# EAGLE design ResponseBoxBncBreakOutV2 (EAGLE 7.3.0)
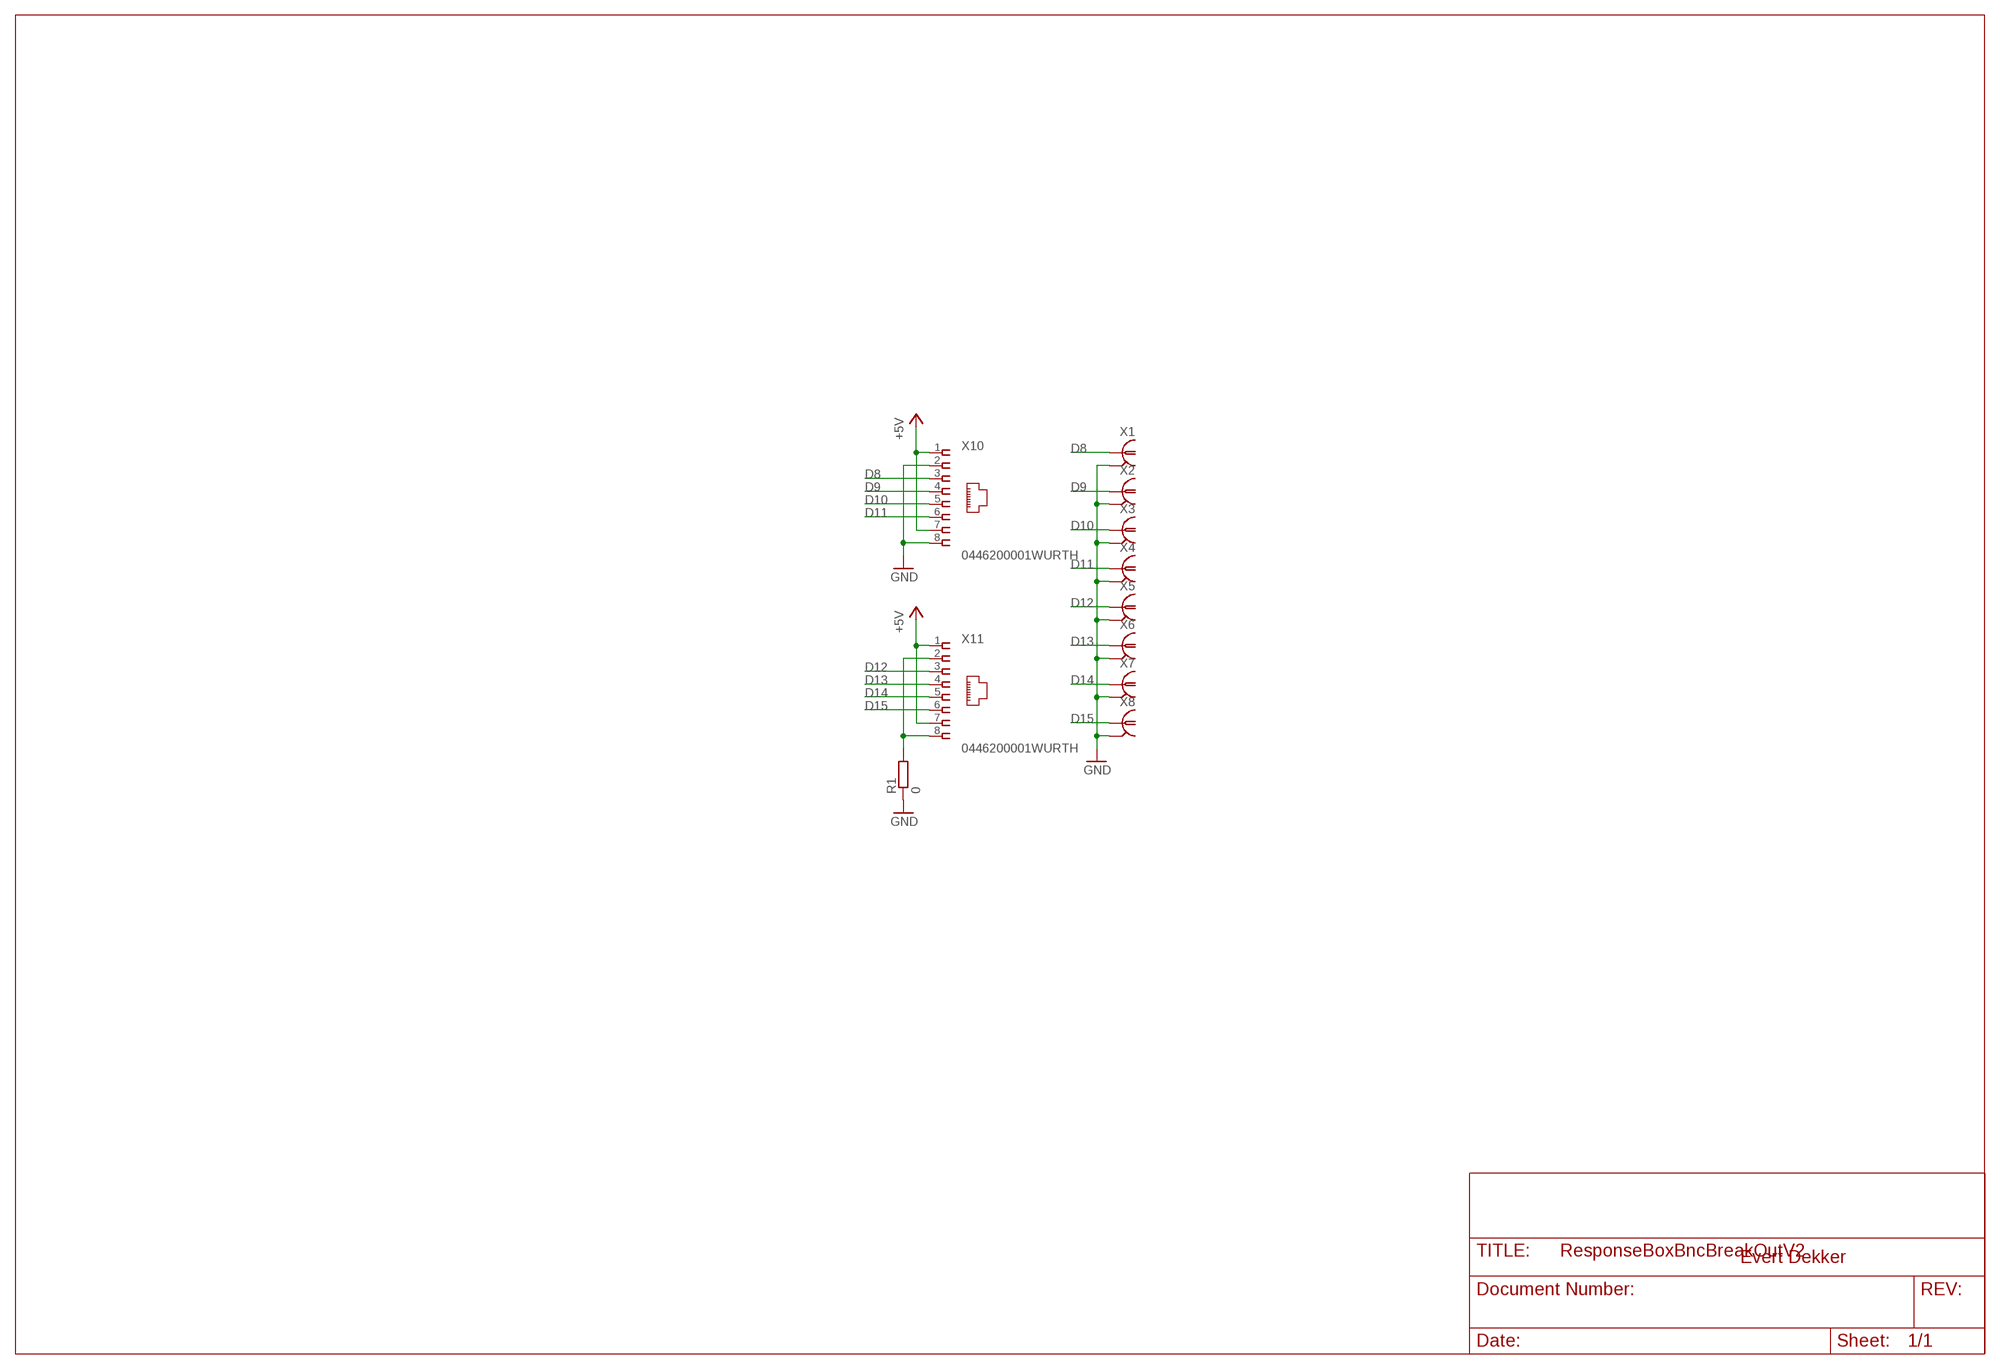
[diagram p0: schematic, sheet 1]

## Parts
R1  0  R-EU_M0805  [M0805]
X1  R141426  [R141426]
X2  R141426  [R141426]
X3  R141426  [R141426]
X4  R141426  [R141426]
X5  R141426  [R141426]
X6  R141426  [R141426]
X7  R141426  [R141426]
X8  R141426  [R141426]
X10  0446200001WURTH  [WURTH-WR-MJ]
X11  0446200001WURTH  [WURTH-WR-MJ]

## Nets
+5V [Vcc]: X10.1 X10.7 X11.1 X11.7
D8: X1.1 X10.3
D9: X2.1 X10.4
D10: X3.1 X10.5
D11: X4.1 X10.6
D12: X5.1 X11.3
D13: X6.1 X11.4
D14: X7.1 X11.5
D15: X8.1 X11.6
GND: R1.1 X1.2 X1.3 X1.4 X1.5 X2.2 X2.3 X2.4 X2.5 X3.2 X3.3 X3.4 X3.5 X4.2 X4.3 X4.4 X4.5 X5.2 X5.3 X5.4 X5.5 X6.2 X6.3 X6.4 X6.5 X7.2 X7.3 X7.4 X7.5 X8.2 X8.3 X8.4 X8.5 X10.2 X10.8
N$1: R1.2 X11.2 X11.8

## Notes on the sheet
- Evert Dekker

## Library data of the parts
R1 = rcl:R-EU_: RESISTOR, European symbol
X1-X8 = con-coax:R141426: BNC COAX CONNECTOR Radiall 50/75 Ohm Spoerle; MF: FARNELL; MPN: R141426161; OC_FARNELL: 4195115; OC_NEWARK: 14J7919
X10 X11 = Rj45Wurth:0446200001: RJ-45 INVERTED MODULAR JACK ASSEMBLY WITH RJ-11 KEEPOUT FEATURE Source: Data sheet <http://www.farnell.com/datasheets/73207.pdf>; FARNELL: 1841170

## Net classes
0 default: width 0.305 mm, clearance 0.203 mm
1 RowCols: width 0.356 mm, clearance 0.203 mm
2 Vcc: width 0.356 mm, clearance 0.203 mm

## Board
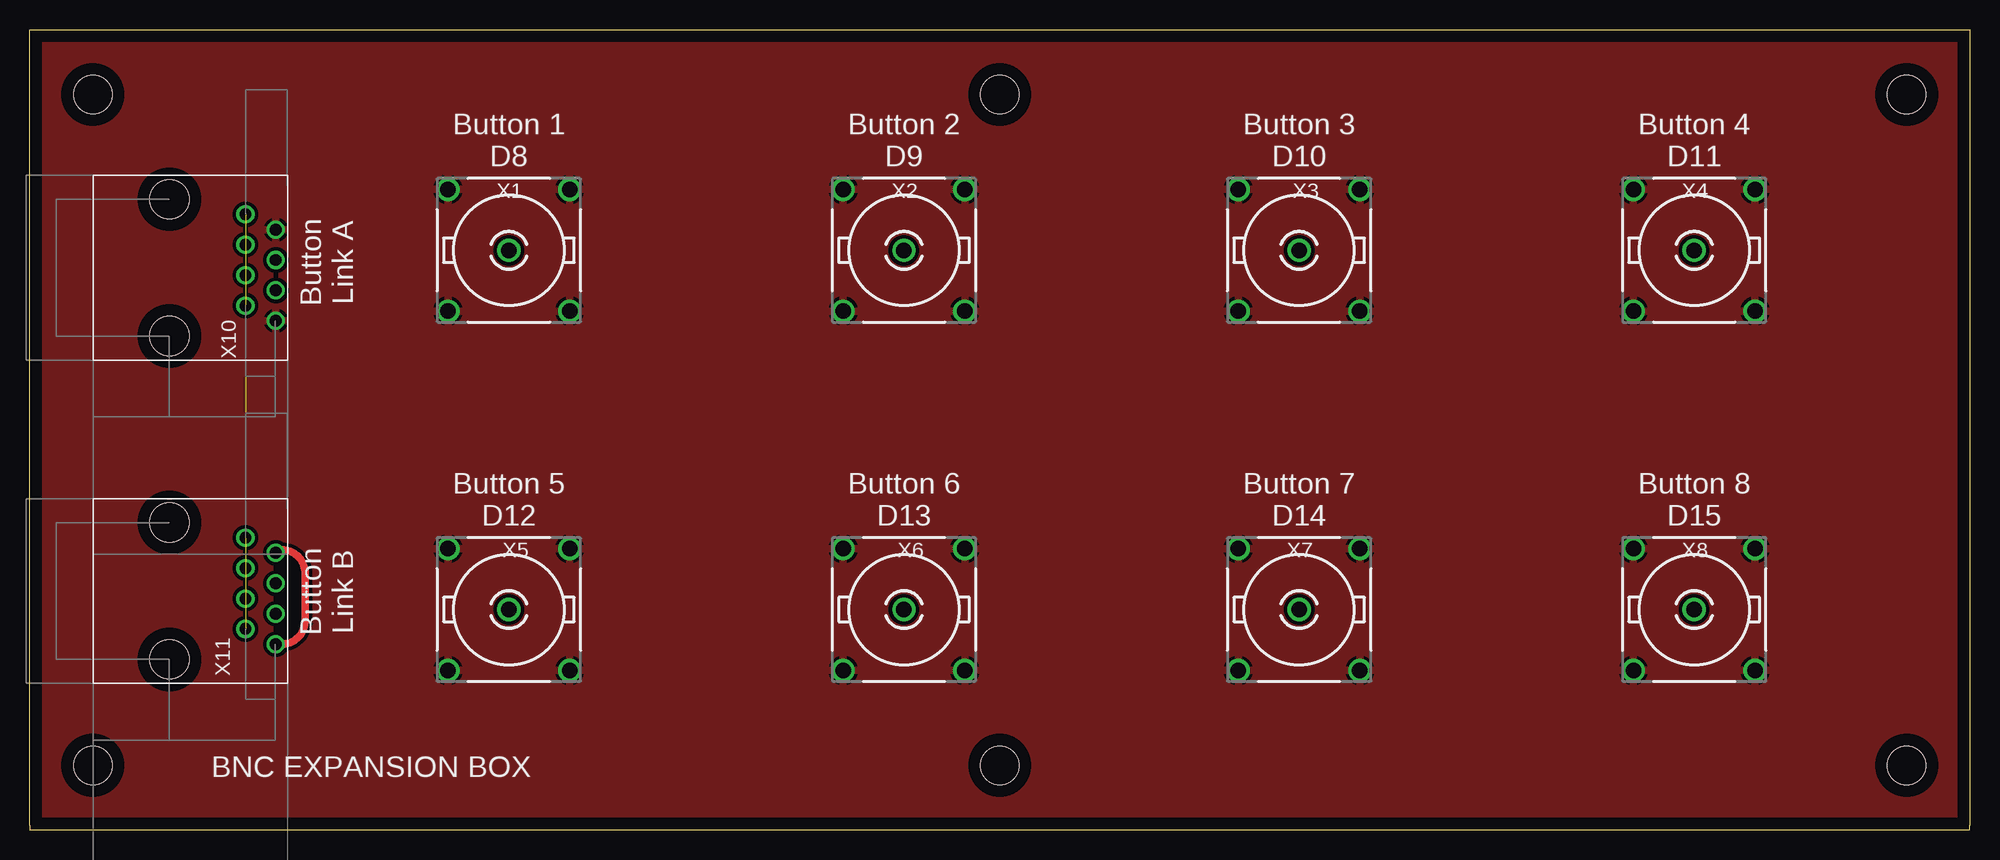
[diagram p1: board, top side]
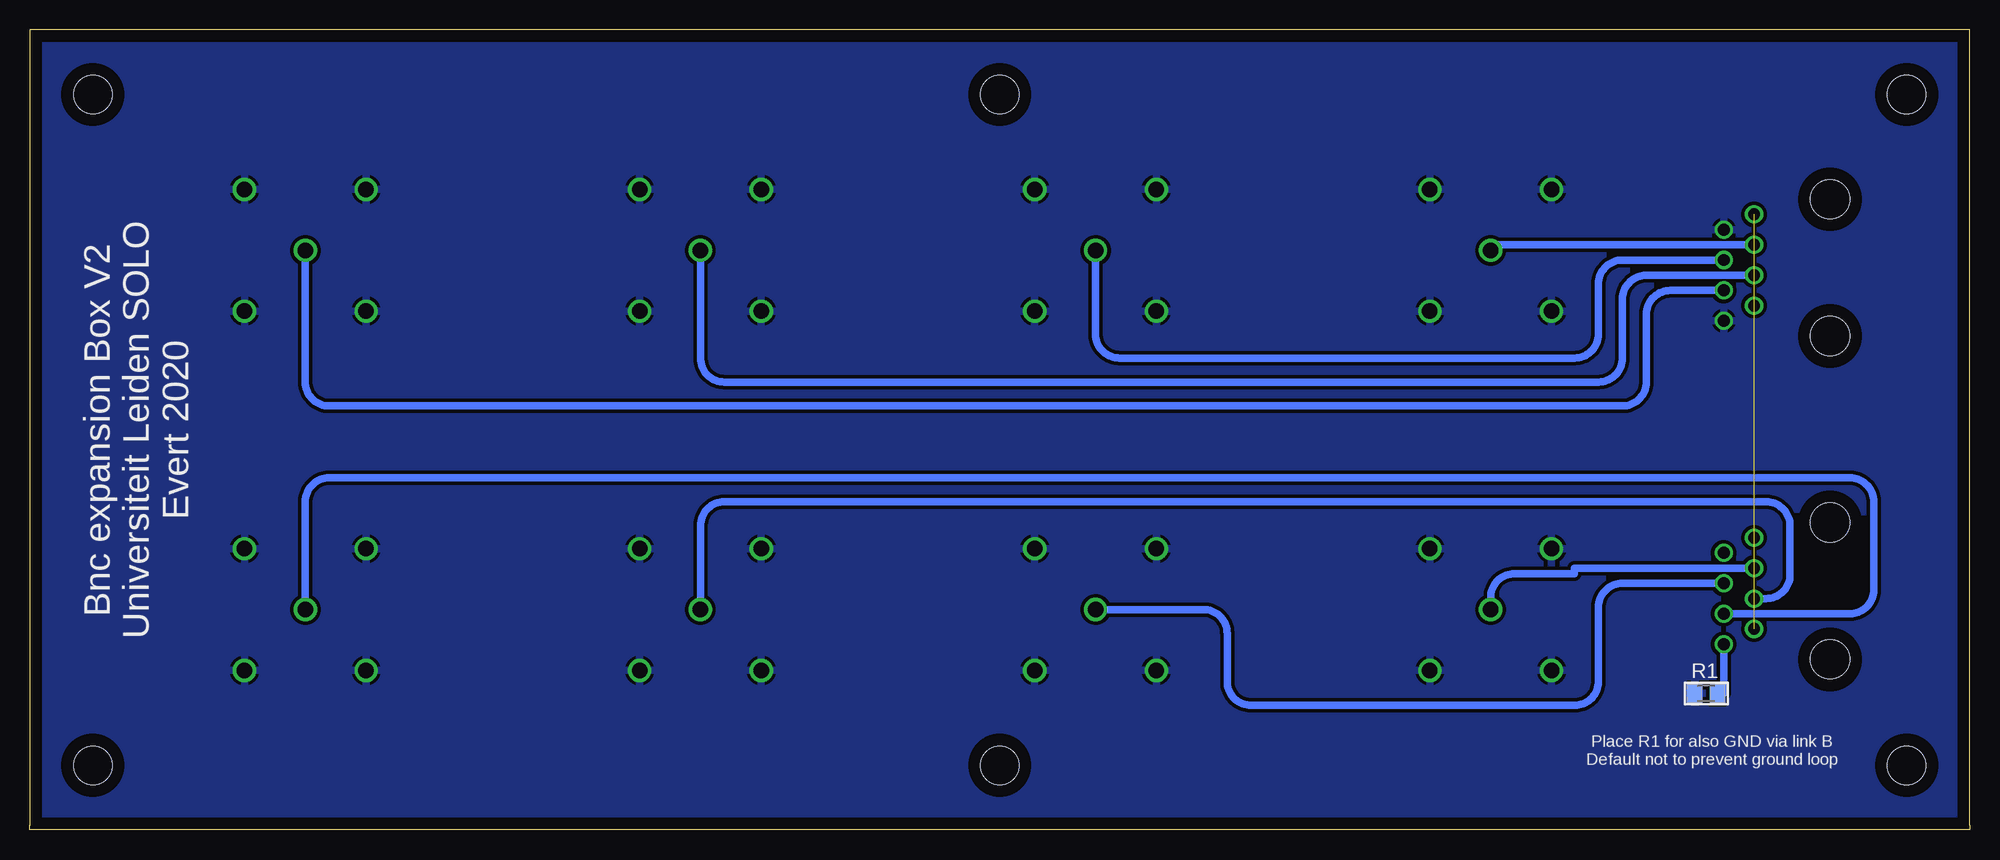
[diagram p2: board, bottom side, seen from below]

Size 162 x 66.8 mm. Coordinates in mm from the lower left corner, seen from the top.
Outline: 162,66.4 162,0.4 162,0 0,0 0,0.4 0,66.4 0,66.8 162,66.8 162,66.4
Copper layers (1*16): Top 0.035mm / dielectric 1.5mm / Bottom 0.035mm
Design rules "default": minimum track width 10mil, minimum drill 24mil, track to track 8mil, track to pad 8mil, pad to pad 8mil, via to via 8mil, smd to smd 8mil, copper to edge 40mil, drill to drill 8mil, minimum pad ring 10mil, minimum via ring 8mil, stop-mask expansion 4mil, vias tented up to drill 0mil, thermal gap 10mil
Holes 3.2 mm at 81,61.4 81,5.4 156.75,61.4 156.75,5.4 5.25,61.4 5.25,5.4

### Footprints (pad centres in the part's own frame; a part is rotated, then mirrored left to right if it is on the bottom)
M0805 = smd 1.3 x 1.6: 1 -0.95,0; 2 0.95,0
R141426 = drill 1.295: 1 0,0; 2 5.08,5.08; 3 -5.08,5.08; 4 -5.08,-5.08; 5 5.08,-5.08
WURTH-WR-MJ = drill 1: 1 0,0; 2 1.27,2.54; 3 2.54,0; 4 3.81,2.54; 5 5.08,0; 6 6.35,2.54; 7 7.62,0; 8 8.89,2.54 | hole 3.25: -1.27,-6.35; 10.16,-6.35

### Placement (x,y rotation side)
R1  22,11.4 0 bottom
X1  40,48.4 0 top
X2  73,48.4 0 top
X3  106,48.4 0 top
X4  139,48.4 0 top
X5  40,18.4 0 top
X6  73,18.4 0 top
X7  106,18.4 0 top
X8  139,18.4 0 top
X10  18,51.4 270 top
X11  18,24.4 270 top

### Tracks (layer width: path | path; a pad name or v marks a point on that pad's centre or on a via)
+5V  (3 unrouted)
D8
  Bottom 0.61: X10.3 40,48.86 X1.1
D9
  Bottom 0.61: X10.4 29,47.59 arc-90 31,45.59 31,41.4 arc90 33,39.4 71,39.4 arc90 73,41.4 X2.1
D10
  Bottom 0.61: X10.5 27,46.32 arc-90 29,44.32 29,39.4 arc90 31,37.4 104,37.4 arc90 106,39.4 X3.1
D11
  Bottom 0.61: X10.6 25,45.05 arc-90 27,43.05 27,37.4 arc90 29,35.4 137,35.4 arc90 139,37.4 X4.1
D12
  Bottom 0.61: X11.3 33,21.86 33,21.4 38,21.4 arc-90 40,19.4 X5.1
D13
  Bottom 0.61: X11.4 29,20.59 arc-90 31,18.59 31,12.4 arc90 33,10.4 60,10.4 arc90 62,12.4 62,16.4 arc-90 64,18.4 X6.1
D14
  Bottom 0.61: X11.5 17,19.32 arc-90 15,21.32 15,25.4 arc-90 17,27.4 95,27.4 104,27.4 arc-90 106,25.4 X7.1
D15
  Bottom 0.61: X11.6 10,18.05 arc-90 8,20.05 8,27.4 arc-90 10,29.4 107,29.4 137,29.4 arc-90 139,27.4 X8.1
GND
  pour Bottom (isolate 0.305): 0.5,66.4 161.5,66.4 161.5,0.4 0.5,0.4
  pour Top (isolate 0.305): 0.5,66.4 161.5,66.4 161.5,0.4 0.5,0.4
N$1
  Top 0.61: X11.8 21,15.51 arc90 23,17.51 23,21.4 arc90 21,23.4 20.54,23.4 X11.2
  Bottom 0.61: R1.2 20.54,11.4 X11.8

### Text on the board
tNames: Button 1 / D8 | Button 2 / D9 | Button 3 / D10 | Button 4 / D11 | Button / Link A | Button 5 / D12 | Button 6 / D13 | Button 7 / D14 | Button 8 / D15 | Button / Link B | BNC EXPANSION BOX
bNames: Bnc expansion Box V2 / Universiteit Leiden SOLO / Evert 2020 | Place R1 for also GND via link B / Default not to prevent ground loop
Document: Change list: / V2 Nieuwe maten buiten zijde 66.8x162